# Altium schematic sheet v2-DCSupplyHub.SchDoc
size A4; SheetNumber: 1; SheetTotal: 5
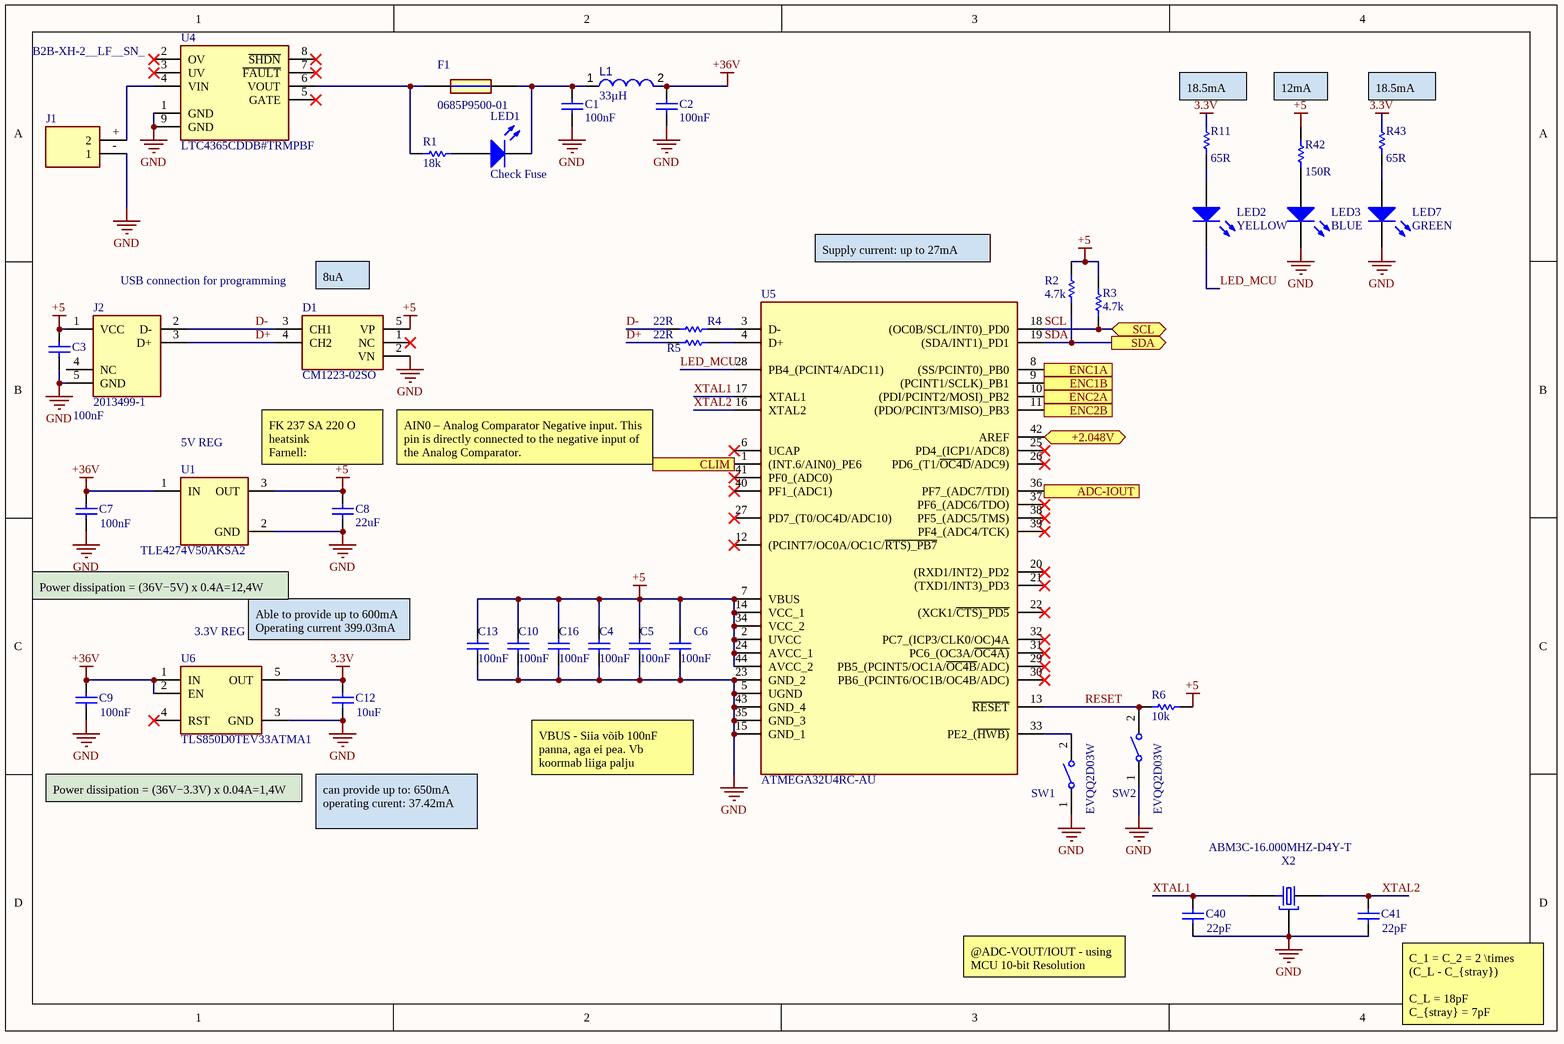
[diagram p0: v2-DCSupplyHub.SchDoc]

## Parts
C1  value 100nF  [Cap_0603]  (hidden comment: Cap)
C2  value 100nF  [Cap_0603]  (hidden comment: Cap)
C3  value 100nF  [Cap_0603]  (hidden comment: Cap)
C4  value 100nF  [Cap_0603]  (hidden comment: Cap)
C5  value 100nF  [Cap_0603]  (hidden comment: Cap)
C6  value 100nF  [Cap_0603]  (hidden comment: Cap)
C7  value 100nF  [Cap_0603]  (hidden comment: Cap)
C8  value 22uF  [Cap_0603]  (hidden comment: Cap)
C9  value 100nF  [Cap_0603]  (hidden comment: Cap)
C10  value 100nF  [Cap_0603]  (hidden comment: Cap)
C12  value 10uF  [Cap_0603]  (hidden comment: Cap)
C13  value 100nF  [Cap_0603]  (hidden comment: Cap)
C16  value 100nF  [Cap_0603]  (hidden comment: Cap)
C40  value 22pF  [Cap_0603]  (hidden comment: Cap)
C41  value 22pF  [Cap_0603]  (hidden comment: Cap)
D1  CM1223-02SO  [SOT95P280X145-5N]
F1  0685P9500-01  [FUSC3216X83N]  (value not drawn)
J1  B2B-XH-2__LF__SN_  [B2BXH2LFSN]
J2  2013499-1  [2013499-1]
L1  value 33µH  [WE-LQS 4018]  (hidden comment: 74404042330)
LED1  Check Fuse  [LED_SMD_0805_R]
LED2  YELLOW  [LED_SMD_0805_R]
LED3  BLUE  [LED_SMD_0805_R]
LED7  GREEN  [LED_SMD_0805_R]
R1  value 18k  [RES_0805]  (hidden comment: Res1)
R2  value 4.7k  [RES_0805]  (hidden comment: Res1)
R3  value 4.7k  [RES_0805]  (hidden comment: Res1)
R4  value 22R  [RES_0805]  (hidden comment: Res1)
R5  value 22R  [RES_0805]  (hidden comment: Res1)
R6  value 10k  [RES_0805]  (hidden comment: Res1)
R11  value 65R  [RES_0805]  (hidden comment: Res1)
R42  value 150R  [RES_0805]  (hidden comment: Res1)
R43  value 65R  [RES_0805]  (hidden comment: Res1)
SW1  EVQQ2D03W  [EVQQ2D03W]
SW2  EVQQ2D03W  [EVQQ2D03W]
U1  TLE4274V50AKSA2  [TO254P440X1000X2110-3P]
U4  LTC4365CDDB#PBF  [SON50P200X300X80-9N-D]  (value not drawn)
U5  ATMEGA32U4-AU  [QFP80P1200X1200X120-44N]  (value not drawn)
U6  TLS850D0TEV33ATMA1  [BTS6143D]
X2  ABM3C-16.000MHZ-D4Y-T  [ABM3C16000MHZD4YT]

## Ports
+2.048V (bidir), ADC-IOUT (in), CLIM (in), ENC1A (in), ENC1B (in), ENC2A (in), ENC2B (in), SCL (bidir), SDA (out)

## Nets
3.3V: C12.2 R11.1 R43.1 U6.5(OUT)
+5: C3.2 C4.2 C5.2 C6.2 C8.1 C10.2 C13.2 C16.2 D1.5(VP) J2.1(VCC) R2.2 R3.2 R6.1 R42.1 U1.3(OUT) U5.2(UVCC) U5.7(VBUS) U5.14(VCC_1) U5.24(AVCC_1) U5.34(VCC_2) U5.44(AVCC_2)
+36V: C2.1 C7.2 C9.2 L1.2 U1.1(IN) U6.1(IN) U6.2(EN)
GND: C1.2 C2.2 C3.1 C4.1 C5.1 C6.1 C7.1 C8.2 C9.1 C10.1 C12.1 C13.1 C16.1 C40.1 C41.1 D1.2(VN) J1.-(1) J2.5(GND) LED3.2(K) LED7.2(K) SW1.1 SW2.1 U1.2(GND) U4.1(GND) U4.9(GND) U5.5(UGND) U5.15(GND_1) U5.23(GND_2) U5.35(GND_3) U5.43(GND_4) U6.3(GND) X2.2(GND) X2.4(GND)
+2.048V: U5.42(AREF) ; port +2.048V
ADC-IOUT: U5.36(PF7_(ADC7/TDI)) ; port ADC-IOUT
CLIM: U5.1((INT.6/AIN0)_PE6) ; port CLIM
D+: D1.4(CH2) J2.3(D+) R5.2
D-: D1.3(CH1) J2.2(D-) R4.2
ENC1A: U5.8((SS/PCINT0)_PB0) ; port ENC1A
ENC1B: U5.9((PCINT1/SCLK)_PB1) ; port ENC1B
ENC2A: U5.10((PDI/PCINT2/MOSI)_PB2) ; port ENC2A
ENC2B: U5.11((PDO/PCINT3/MISO)_PB3) ; port ENC2B
LED_MCU: LED2.2(K) U5.28(PB4_(PCINT4/ADC11))
RESET: R6.2 SW2.2 U5.13(~{RESET})
SCL: R3.1 U5.18((OC0B/SCL/INT0)_PD0) ; port SCL
SDA: R2.1 U5.19((SDA/INT1)_PD1) ; port SDA
XTAL1: C40.2 U5.17(XTAL1) X2.1
XTAL2: C41.2 U5.16(XTAL2) X2.3
NetC1_1: C1.1 F1.2 L1.1 LED1.2(K)
NetF1_1: F1.1 R1.2 U4.6(VOUT)
NetJ1_+: J1.+(2) U4.4(VIN)
NetLED1_1: LED1.1(A) R1.1
NetLED2_1: LED2.1(A) R11.2
NetLED3_1: LED3.1(A) R42.2
NetLED7_1: LED7.1(A) R43.2
NetR4_1: R4.1 U5.3(D-)
NetR5_1: R5.1 U5.4(D+)
NetSW1_2: SW1.2 U5.33(PE2_(~{HWB)})

Not connected (* = marked no-connect by the designer): D1 1(NC)*; J2 4(NC); U4 2(OV)* 3(UV)* 5(GATE)* 7(~{FAULT})* 8(~{SHDN})*; U5 6(UCAP)* 12((PCINT7/OC0A/OC1C/~{RTS)_PB7})* 20((RXD1/INT2)_PD2)* 21((TXD1/INT3)_PD3)* 22((XCK1/~{CTS)_PD5})* 25(PD4_(ICP1/ADC8))* 26(PD6_(T1/~{OC4D}/ADC9))* 27(PD7_(T0/OC4D/ADC10))* 29(PB5_(PCINT5/OC1A/~{OC4B}/ADC))* 30(PB6_(PCINT6/OC1B/OC4B/ADC))* 31(PC6_(OC3A/~{OC4A)})* 32(PC7_(ICP3/CLK0/OC)4A)* 37(PF6_(ADC6/TDO))* 38(PF5_(ADC5/TMS))* 39(PF4_(ADC4/TCK))* 40(PF1_(ADC1))* 41(PF0_(ADC0))*; U6 4(RST)*

## Notes on the sheet
- (near R11) 18.5mA
- 12mA
- (near R43) 18.5mA
- USB connection for programming
- (near D1) 8uA
- Supply current: up to 27mA
- 5V REG
- FK 237 SA 220 O heatsink
  Farnell:
- AIN0 – Analog Comparator Negative input. This pin is directly connected to the negative input of the Analog Comparator.
- Power dissipation = (36V−5V) x 0.4A=12,4W
- (near U6) 3.3V REG
- Able to provide up to 600mA
  Operating current 399.03mA
- VBUS - Siia võib 100nF panna, aga ei pea. Vb koormab liiga palju
- Power dissipation = (36V−3.3V) x 0.04A=1,4W
- can provide up to: 650mA
  operating curent: 37.42mA
- @ADC-VOUT/IOUT - using MCU 10-bit Resolution
- (near C41) C_1 = C_2 = 2 \times (C_L - C_{stray})
  C_L = 18pF
  C_{stray} = 7pF
- (in symbol ATMEGA32U4-AU) ATMEGA32U4RC-AU
- (in symbol LTC4365CDDB#PBF) LTC4365CDDB#TRMPBF

## Library data of the parts
C1-C10 C12 C13 C16 C40 C41 = Cap: Capacitor; Published: 8-Jun-2000; LatestRevisionDate: 17-Jul-2002; LatestRevisionNote: Re-released for DXP Platform.; PackageReference: RAD-0.3; Publisher: Altium Limited; PackageDescription: Radial Cap, Thru-Hole; 2 Leads; 0.3 in Pin Spacing
D1 = CM1223-02SO: TVS Diode (Uni-directional); Manufacturer_Name: onsemi; Datasheet Link: https://www.onsemi.com/pdf/datasheet/cm1223-d.pdf; Height: 1.45mm; Manufacturer_Part_Number: CM1223-02SO; Mouser Part Number: 748-CM1223-02SO; Mouser Price/Stock: https://www.mouser.co.uk/ProductDetail/onsemi/CM1223-02SO?qs=lLuKAerq7nnvVg3rEtIojA%3D%3D; ComponentLink1Description: Datasheet; ComponentLink1URL: https://www.onsemi.com/pdf/datasheet/cm1223-d.pdf
F1 = 0685P9500-01: Fuse Chip Fast Acting 50A 32V SMD Solder Pad 1206 3.2 X 1.58 X 0.63mm Ceramic T/R; Manufacturer_Name: Bel Circuit Protection; Geometry.Height: 0.83mm; Manufacturer_Part_Number: 0685P9500-01; Mouser Part Number: *; Mouser Price/Stock: *; Arrow Part Number: 0685P9500-01; Arrow Price/Stock: https://www.arrow.com/en/products/0685p9500-01/bel-group?region=europe; Datasheet Link: https://www.arrow.com/en/products/0685p9500-01/bel-group
J1 = B2B-XH-2__LF__SN_: Connector; Manufacturer_Name: JST (JAPAN SOLDERLESS TERMINALS); Manufacturer_Part_Number: B2B-XH-2 (LF)(SN); Datasheet Link: http://uk.rs-online.com/web/p/products/1755297; Height: 7mm; Arrow Part Number: B2B-XH-2 (LF)(SN); Arrow Price/Stock: https://www.arrow.com/en/products/b2b-xh-2-lf-sn/jst-manufacturing?region=europe
J2 = 2013499-1: Connector; Manufacturer_Name: TE Connectivity; Datasheet Link: http://www.te.com/commerce/DocumentDelivery/DDEController?Action=showdoc&DocId=Customer+Drawing%7F2013499%7FB2%7Fpdf%7FEnglish%7FENG_CD_2013499_B2.pdf%7F2013499-1; Manufacturer_Part_Number: 2013499-1; Mouser Part Number: 571-2013499-1; Mouser Price/Stock: https://www.mouser.co.uk/ProductDetail/TE-Connectivity/2013499-1?qs=TL6PIybY3BOLK37GbUYdng%3D%3D; Arrow Part Number: 2013499-1; Arrow Price/Stock: https://www.arrow.com/en/products/2013499-1/te-connectivity?region=nac; ComponentLink1Description: Datasheet; ComponentLink1URL: https://cdn.amphenol-cs.com/media/wysiwyg/files/documentation/datasheet/inputoutput/io_usb_micro.pdf
L1 = CMP-006-00018-3: WE-LQS SMD Power Inductor, L=33 µH; Tolerance: 20%; ComponentLink2URL: http://katalog.we-online.de/pbs/datasheet/74404042330.pdf; ComponentLink1URL: http://www.we-online.com; ComponentLink2Description: Datasheet; Pins: 2; ComponentLink1Description: Manufacturer URL
LED1-LED3 LED7 = LED2: Typical RED, GREEN, YELLOW, AMBER GaAs LED; Published: 8-Jun-2000; LatestRevisionDate: 17-Jul-2002; LatestRevisionNote: Re-released for DXP Platform.; PackageVersion: Feb-2002; PackageReference: 3.2X1.6X1.1; Publisher: Altium Limited; PackageDescription: SM LED; 2 Flat Leads
R1-R6 R11 R42 R43 = Res1: Resistor; Published: 8-Jun-2000; LatestRevisionDate: 17-Jul-2002; LatestRevisionNote: Re-released for DXP Platform.; PackageReference: AXIAL-0.3; Publisher: Altium Limited; PackageDescription: Axial Device, Thru-Hole; 2 Leads; 0.3 in Pin Spacing
SW1 SW2 = SW-SPST-2_C: FSMSM Push Button Switch, 50 mA, -35 to 85 degC, 2-Pin SMD, RoHS, Tape and Reel; Manufacturer: TE Connectivity; Voltage Rating (DC): 24V; Electrical Life: 20000Cycles; Operating Force: 180gf; Switch Travel: 0.25mm; Contact Current Rating: 50mA; Case\/Package: SMD/SMT; Actuator Length: 1.07mm; Throw Configuration: SPST; Actuator Material: Polyamide; Contact Resistance: 100mOhm; Illumination Type: Illuminated; Max Voltage Rating (DC): 12V; Manufacturer URL: http://www.te.com/; Lead Free: LeadFree; Packaging: TapeandReel; Min Operating Temperature: -35degC; Mechanical Life: 20000Cycles; Mount: SurfaceMount; REACH SVHC: Unknown; Package Quantity: 1800; Package Reference: FSMSMTR; RoHSCompliant: true; Max Operating Temperature: 85degC; Orientation: Straight; ELV: Compliant; Datasheet URL: http://www.te.com/commerce/DocumentDelivery/DDEController?Action=showdoc&DocId=Customer+Drawing%7F1437566-3%7FC2%7Fpdf%7FEnglish%7FENG_CD_1437566-3_C2_1437566_3_1_c.dwg.pdf%7F1437566-4; Package Description: 2-Pin Surface Mount Device, Body 6 x 3.5 mm, Pitch 9.19 mm; Current Rating: 50mA; Contact Plating: Silver; Termination: GullWing; Datasheet Version: Rev. C2, 08/2014; Contact Material: Brass; Mounting Technology: SurfaceMount; ComponentLink1Description: Datasheet; ComponentLink1URL: https://www.farnell.com/datasheets/2244072.pdf
U1 = TLE4274DV50ATMA2: LDO, FIXED, 5V, 0.4A, -40 TO 150DEG C; Manufacturer_Name: Infineon; Datasheet Link: https://www.mouser.com/datasheet/2/196/Infineon-TLE4274-DS-v01_70-EN-1133217.pdf; Height: 2mm; Manufacturer_Part_Number: TLE4274DV50ATMA2; Mouser Part Number: 726-TLE4274DV50ATMA2; Mouser Price/Stock: https://www.mouser.co.uk/ProductDetail/Infineon-Technologies/TLE4274DV50ATMA2/?qs=IxCaM9nJKKWmxkR9ksyK2Q%3D%3D; Arrow Part Number: TLE4274DV50ATMA2; Arrow Price/Stock: https://www.arrow.com/en/products/tle4274dv50atma2/infineon-technologies-ag?region=nac; ComponentLink1Description: Datasheet; ComponentLink1URL: https://www.mouser.com/datasheet/2/196/Infineon-TLE4274-DS-v01_70-EN-1133217.pdf
U4 = LTC4365CDDB#PBF: vervoltage, Undervoltage and Reverse Supply Protection Controller; Manufacturer_Name: Analog Devices; Datasheet Link: http://cds.linear.com/docs/en/datasheet/4365fa.pdf; Height: 0.8mm; Manufacturer_Part_Number: LTC4365CDDB#PBF; Mouser Part Number: 584-LTC4365CDDB#PBF; Mouser Price/Stock: https://www.mouser.com/Search/Refine.aspx?Keyword=584-LTC4365CDDB%23PBF; ComponentLink1Description: Datasheet; ComponentLink1URL: https://www.analog.com/media/en/technical-documentation/data-sheets/LTC4365.pdf
U5 = ATMEGA32U4-AU: MCU AVR 32K FLASH 16MHZ 44-TQFP Atmel ATMEGA32U4-AU, 8bit AVR Microcontroller, 16MHz, 1 kB, 32 kB Flash, 44-Pin TQFP; Manufacturer_Name: Microchip; Geometry.Height: 1.2mm; Manufacturer_Part_Number: ATMEGA32U4-AU; Mouser Part Number: 556-ATMEGA32U4-AU; Mouser Price/Stock: https://www.mouser.co.uk/ProductDetail/Microchip-Technology/ATMEGA32U4-AU?qs=SSucg2PyLi7mKWjHIsNJ3w%3D%3D; Arrow Part Number: ATMEGA32U4-AU; Arrow Price/Stock: https://www.arrow.com/en/products/atmega32u4-au/microchip-technology?region=nac; Datasheet Link: http://www.atmel.com/images/atmel-7766-8-bit-avr-atmega16u4-32u4_summary.pdf; ComponentLink1Description: Datasheet; ComponentLink1URL: https://ww1.microchip.com/downloads/en/DeviceDoc/Atmel-7766-8-bit-AVR-ATmega16U4-32U4_Datasheet.pdf
U6 = TLS850D0TEV33ATMA1: LDO VOltage regulator; Manufacturer_Name: Infineon; Datasheet Link: https://www.arrow.com/en/products/tls850d0tev33atma1/infineon-technologies-ag; Height: 2mm; Manufacturer_Part_Number: TLS850D0TEV33ATMA1; Mouser Part Number: 726-TLS850D0TEV33ATM; Mouser Price/Stock: https://www.mouser.co.uk/ProductDetail/Infineon-Technologies/TLS850D0TEV33ATMA1?qs=lJkB7%252BtQNiOAXKJxyf22ag%3D%3D; Arrow Part Number: TLS850D0TEV33ATMA1; Arrow Price/Stock: https://www.arrow.com/en/products/tls850d0tev33atma1/infineon-technologies-ag; ComponentLink1Description: Datasheet; ComponentLink1URL: https://4donline.ihs.com/images/VipMasterIC/IC/INFN/INFN-S-A0003268371/INFN-S-A0003268371-1.pdf?hkey=6D3A4C79FDBF58556ACFDE234799DDF0
X2 = ABM3C-16.000MHZ-D4Y-T: 16MHz Â±30ppm Crystal 18pF 50 Ohms 4-SMD, No Lead; MF: Abracon; Price: None; Value: *; Package: SMD-4 Abracon; Availability: Unavailable; SnapEDA_Link: https://www.snapeda.com/parts/ABM3C-16.000MHZ-D4Y-T/Abracon%20LLC/view-part/463692/?ref=snap; MP: ABM3C-16.000MHZ-D4Y-T; Supplier 1: Arrow Electronics; Supplier Part Number 1: ABM3C-16.000MHZ-D4Y-T; ComponentLink1Description: Datasheet; ComponentLink1URL: https://www.mouser.ee/datasheet/2/3/abm3c-1775120.pdf